# EAGLE design SmoothieboardGlcdAdapter2 (EAGLE 6.6.0)
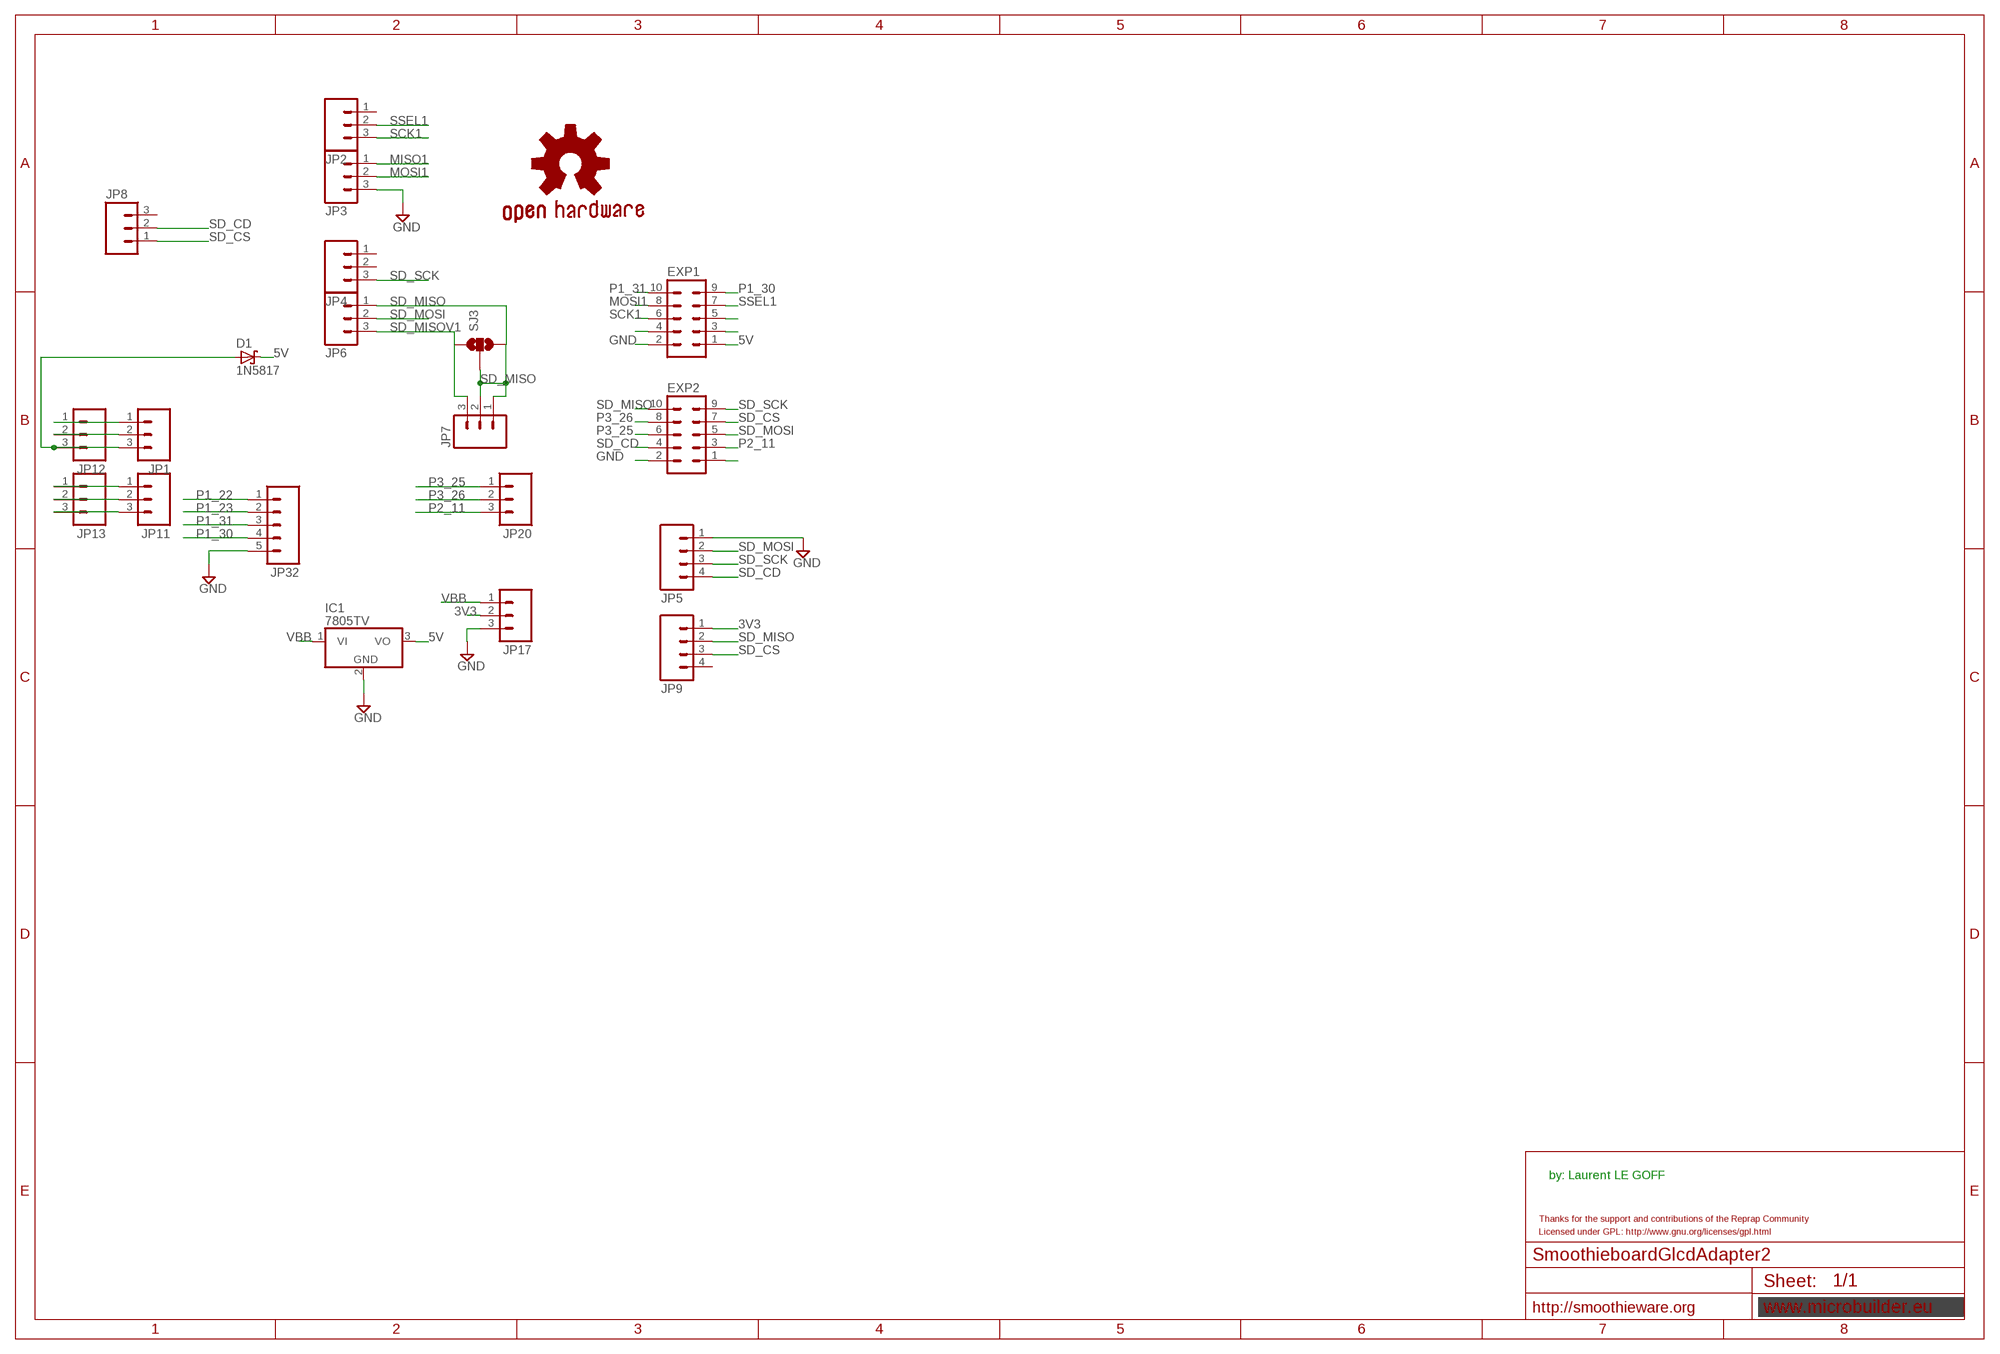
[diagram p0: schematic, sheet 1]

## Parts
D1  1N5817  1N5817-B  [DO41-7.6]
EXP1  ML10  [ML10]
EXP2  ML10  [ML10]
GOLD_ORB_SM1  OSHWLOGO_GOLD_ORB_MED  [OSHW1]
IC1  7805TV  [TO220V]
JP1  M03PTH  [1X03]
JP2  M031X03_NO_SILK  [1X03_NO_SILK]
JP3  M031X03_NO_SILK  [1X03_NO_SILK]
JP4  M031X03_NO_SILK  [1X03_NO_SILK]
JP5  M041X04_NO_SILK  [1X04_NO_SILK]
JP6  M031X03_NO_SILK  [1X03_NO_SILK]
JP7  M03PTH  [1X03]
JP8  M03PTH  [1X03]
JP9  M041X04_NO_SILK  [1X04_NO_SILK]
JP11  M03PTH  [1X03]
JP12  M03PTH  [1X03]
JP13  M03PTH  [1X03]
JP17  M03PTH  [1X03]
JP20  M03PTH  [1X03]
JP32  M05PTH  [1X05]
SJ3  SOLDERJUMPER_2WAYS  [SJ_3]

## Nets
3V3: JP9.1 JP17.2
5V: D1.C EXP1.1 IC1.3(VO)
GND: EXP1.2 EXP2.2 IC1.2(GND) JP3.3 JP5.1 JP17.3 JP32.5
MISO1: JP3.1
MOSI1: EXP1.8 JP3.2
N$1: D1.A JP1.3 JP12.3
N$2: JP1.1 JP12.1
N$3: JP1.2 JP12.2
N$5: EXP1.4
N$6: JP11.1 JP13.1
N$7: JP11.2 JP13.2
N$8: JP11.3 JP13.3
N$9: EXP1.5
N$10: EXP1.3
N$21: EXP2.1
P1_22: JP32.1
P1_23: JP32.2
P1_30: EXP1.9 JP32.4
P1_31: EXP1.10 JP32.3
P2_11: EXP2.3 JP20.3
P3_25: EXP2.6 JP20.1
P3_26: EXP2.8 JP20.2
SCK1: EXP1.6 JP2.3
SD_CD: EXP2.4 JP5.4 JP8.2
SD_CS: EXP2.7 JP8.1 JP9.3
SD_MISO: EXP2.10 JP6.1 JP7.1 JP7.2 JP9.2 SJ3.2 SJ3.3
SD_MISOV1: JP6.3 JP7.3 SJ3.1
SD_MOSI: EXP2.5 JP5.2 JP6.2
SD_SCK: EXP2.9 JP4.3 JP5.3
SSEL1: EXP1.7 JP2.2
VBB: IC1.1(VI) JP17.1
Unconnected: JP2.1 JP4.1 JP4.2 JP8.3 JP9.4

## Notes on the sheet
- by: Laurent LE GOFF
- Thanks for the support and contributions of the Reprap Community
- Licensed under GPL: http://www.gnu.org/licenses/gpl.html
- http://smoothieware.org

## Library data of the parts
D1 = diode:1N581*: 1.0A SCHOTTKY BARRIER RECTIFIER Source: http://www.diodes.com/datasheets/ds23001.pdf
EXP1 EXP2 = con-harting-ml:ML10: HARTING; OC_FARNELL: unknown; OC_NEWARK: unknown
GOLD_ORB_SM1 = bfl:OSHWLOGO: These are Open-Source Hardware logos.
IC1 = linear:78*: Positive VOLTAGE REGULATOR Source: http://cache.national.com/ds/LM/LM78L05.pdf http://www.fairchildsemi.com/ds/LM/LM7805.pdf
JP1-JP4 JP6-JP8 JP11-JP13 JP17 JP20 = SparkFun:M03: Header 3 Standard 3-pin 0.1" header. Use with straight break away headers (SKU : PRT-00116), right angle break away headers (PRT-00553), swiss pins (PRT-00743), machine pins (PRT-00117), and female headers (PRT-00115). Molex polarized connector foot print use with SKU : PRT-08232 with associated crimp pins and housings.
JP5 JP9 = SparkFun:M04: Header 4 Standard 4-pin 0.1" header. Use with straight break away headers (SKU : PRT-00116), right angle break away headers (PRT-00553), swiss pins (PRT-00743), machine pins (PRT-00117), and female headers (PRT-00115). Molex polarized connector foot print use with SKU : PRT-08231 with associated crimp pins and housings. 1MM SMD Version SKU: PRT-10208
JP32 = SparkFun:M05: Header 5 Standard 5-pin 0.1" header. Use with straight break away headers (SKU : PRT-00116), right angle break away headers (PRT-00553), swiss pins (PRT-00743), machine pins (PRT-00117), and female headers (PRT-00115). Molex polarized connector foot print use with SKU : PRT-08230 with associated crimp pins and housings.
SJ3 = SparkFun:SOLDERJUMPER_2WAY: Solder Jumper 2 way solder jumper

## Board
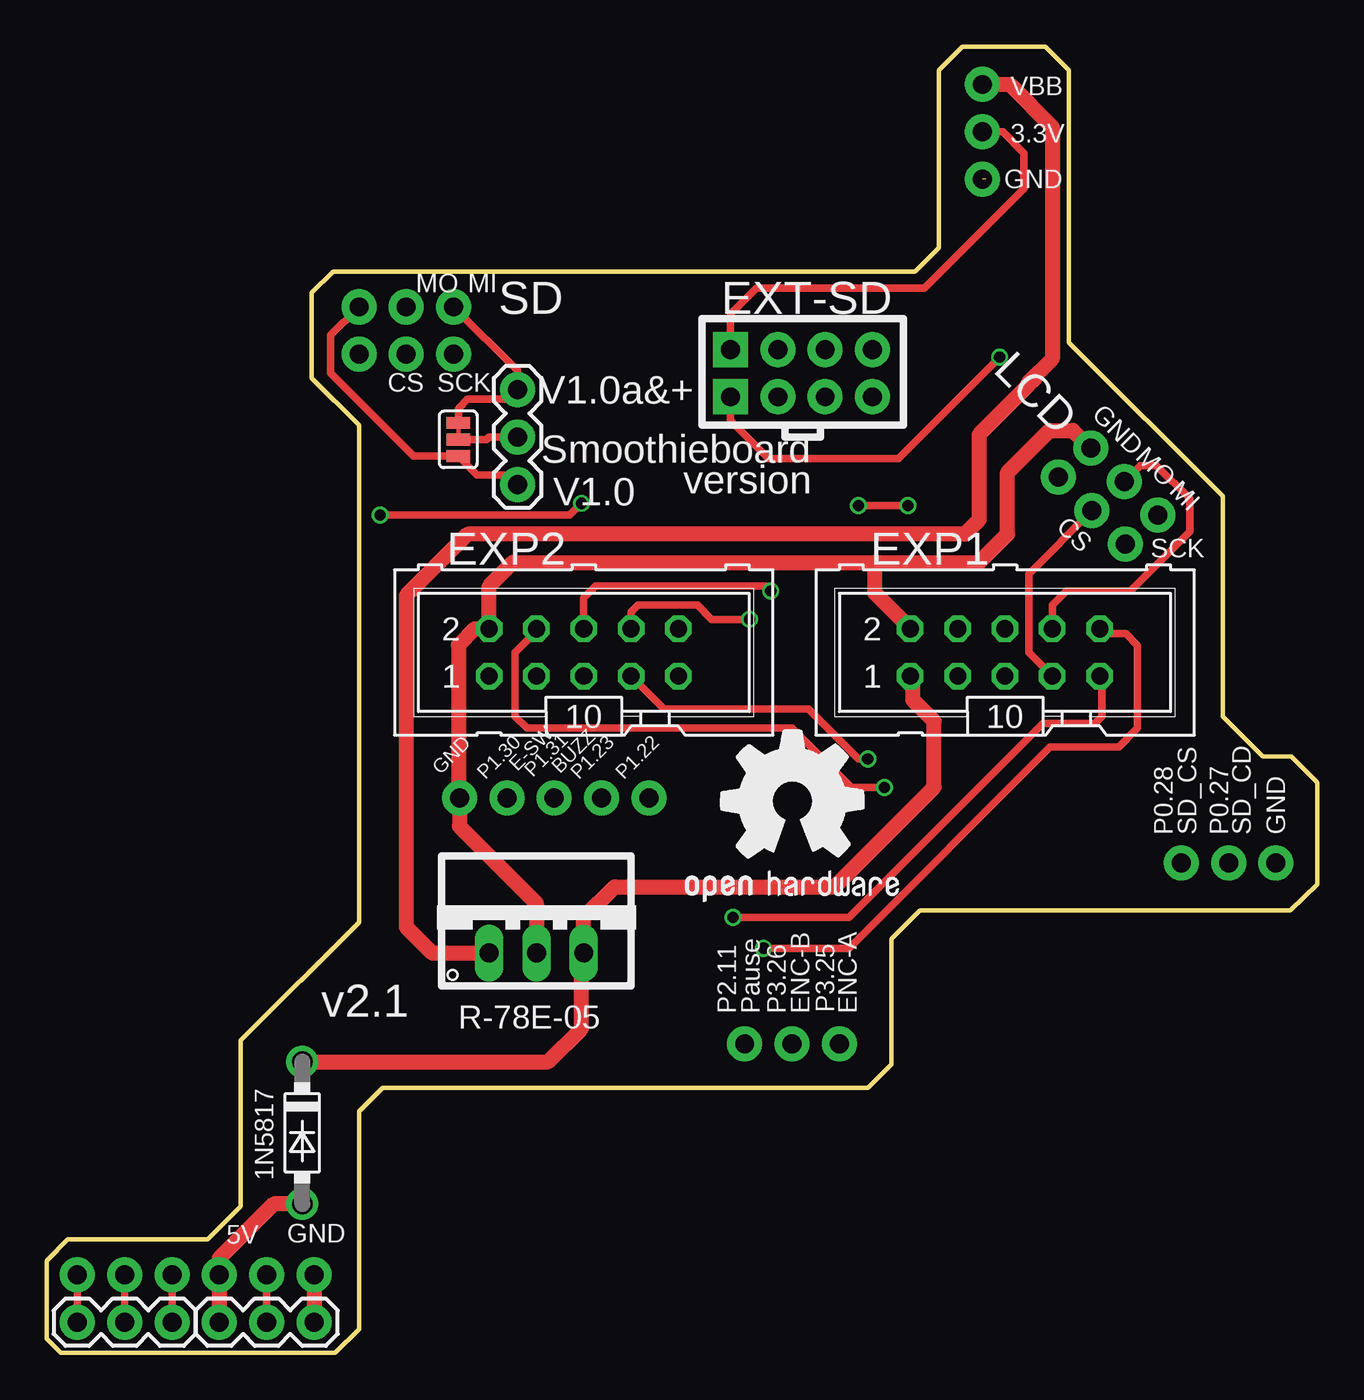
[diagram p1: board, top side]
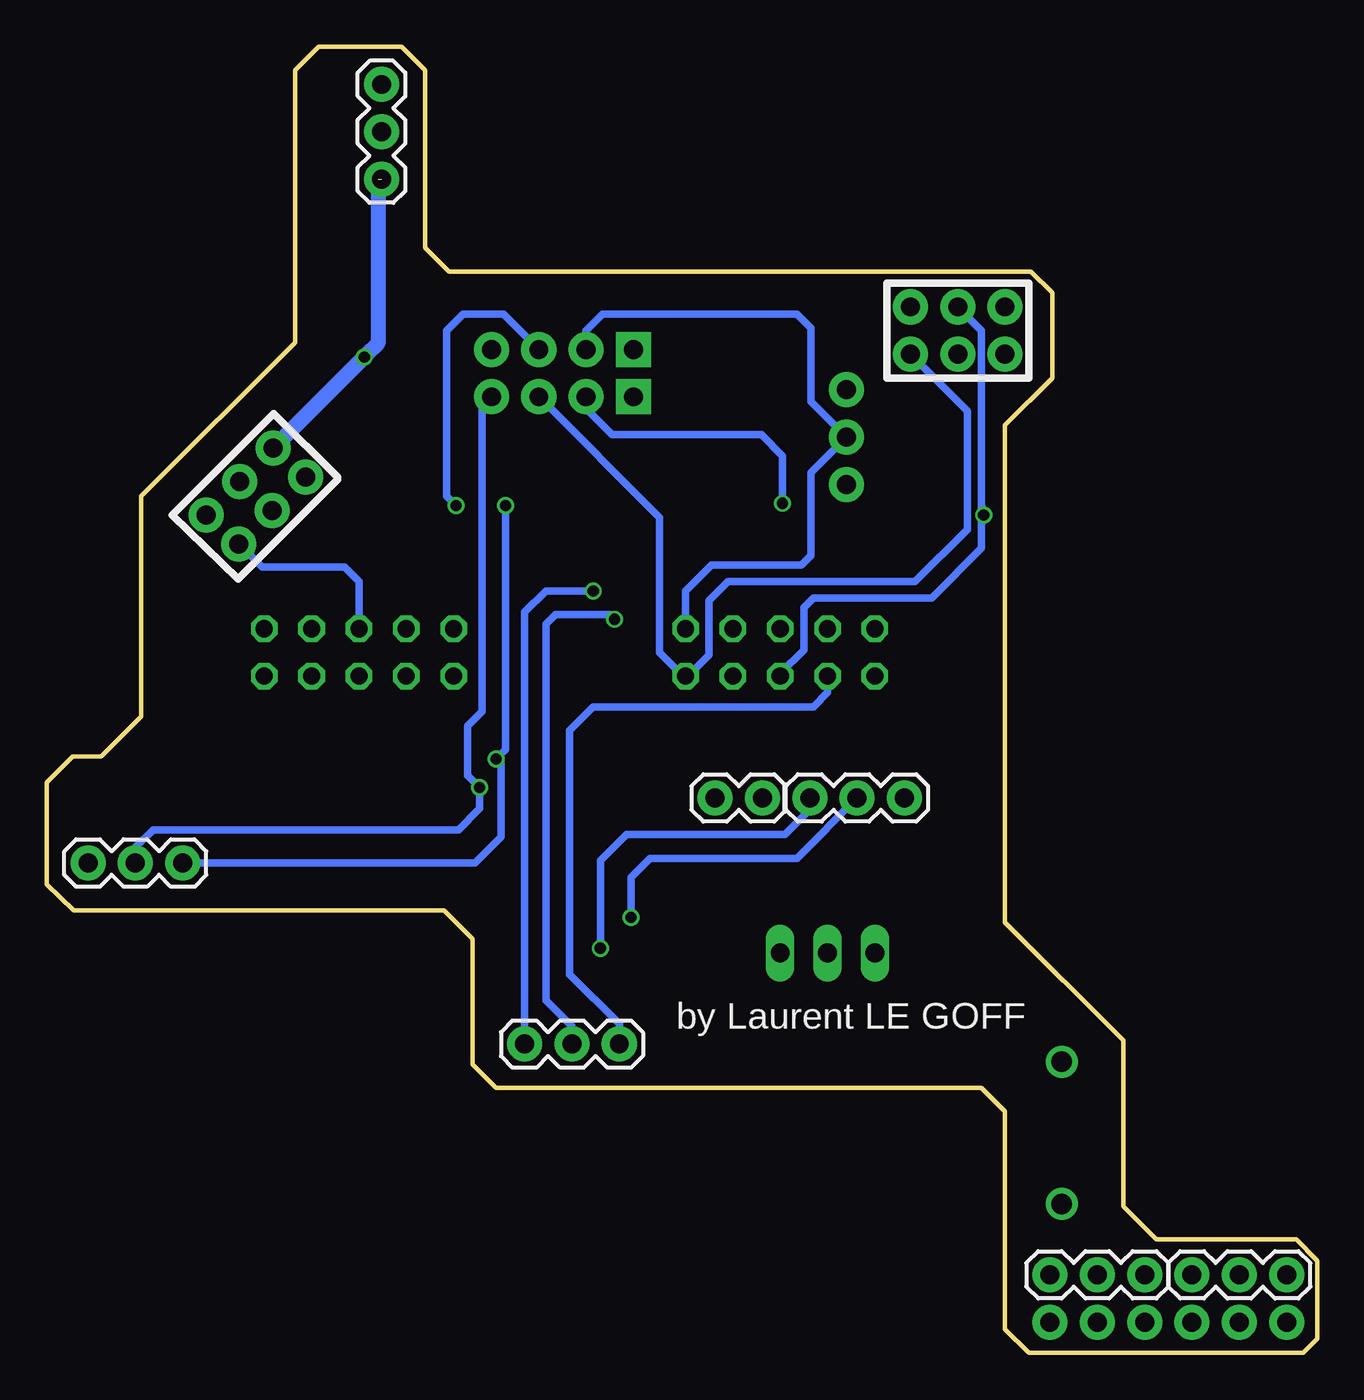
[diagram p2: board, bottom side, seen from below]

Size 68.2 x 70.1 mm. Coordinates in mm from the lower left corner, seen from the top.
Outline: 15.37,58.04 46.61,58.04 47.88,59.31 47.88,68.83 49.15,70.1 53.59,70.1 54.86,68.83 54.86,54.23 63.12,45.97 63.12,34.16 65.28,32 66.8,32 68.2,30.61 68.2,25.15 66.74,23.75 46.86,23.75 45.34,22.23 45.34,15.49 44.07,14.22 18.03,14.22 16.76,12.95 16.76,1.27 15.49,0 0.76,0 0,0.76 0,4.95 1.14,6.1 8.64,6.1 10.41,7.87 10.41,16.76 16.76,23.11 16.76,49.78 14.22,52.32 14.22,56.9 15.37,58.04
Copper layers (1*16): Top 0.035mm / dielectric 1.5mm / Bottom 0.035mm
Design rules "dirt_cheap_dirty_boards.v1": minimum track width 5mil, minimum drill 12mil, track to track 5mil, track to pad 5mil, pad to pad 5mil, via to via 5mil, smd to smd 0mil, copper to edge 10mil, drill to drill 10mil, minimum pad ring 10mil, minimum via ring 6mil, stop-mask expansion 2mil, vias tented up to drill 25mil, thermal gap 10mil
tRestrict: 72 lines

### Footprints (pad centres in the part's own frame; a part is rotated, then mirrored left to right if it is on the bottom)
DO41-7.6 = drill 1.1 pad 1.7: A 3.81,0; C -3.81,0
ML10 = drill 0.914 octagon: 1 -5.08,-1.27; 2 -5.08,1.27; 3 -2.54,-1.27; 4 -2.54,1.27; 5 0,-1.27; 6 0,1.27; 7 2.54,-1.27; 8 2.54,1.27; 9 5.08,-1.27; 10 5.08,1.27
TO220V = drill 1.016 long: 1 -2.54,-2.54; 2 0,-2.54; 3 2.54,-2.54
1X03 = drill 1.016 pad 1.88: 1 0,0; 2 2.54,0; 3 5.08,0
1X03_NO_SILK = drill 1.016 pad 1.88: 1 0,0; 2 2.54,0; 3 5.08,0
1X04_NO_SILK = drill 1.016 pad 1.88 square: 1 0,0 | drill 1.016 pad 1.88: 2 2.54,0; 3 5.08,0; 4 7.62,0
1X05 = drill 1.016 pad 1.88: 1 0,0; 2 2.54,0; 3 5.08,0; 4 7.62,0; 5 10.16,0
SJ_3 = smd 0.635 x 1.27: 1 -0.889,0; 2 0,0; 3 0.889,0

### Placement (x,y rotation side)
D1  13.72,11.81 270 top
EXP1  51.44,37.59 0 top
EXP2  28.83,37.59 0 top
GOLD_ORB_SM1  33.66,22.48 0 top
IC1  26.29,24 0 top
JP1  14.35,1.65 180 top
JP2  54.29,46.99 315 top
JP3  59.63,44.96 135 top
JP4  16.76,53.59 0 top
JP5  36.7,51.31 0 top
JP6  21.84,56.13 180 top
JP7  25.27,51.69 270 top
JP8  60.9,26.29 180 bottom
JP9  36.7,53.85 0 top
JP11  1.65,4.19 180 bottom
JP12  14.35,4.19 0 bottom
JP13  1.65,1.65 0 top
JP17  50.23,68.07 270 bottom
JP20  42.55,16.57 0 bottom
JP32  32.32,29.78 0 bottom
SJ3  22.1,49.02 90 top

### Tracks (layer width: path | path; a pad name or v marks a point on that pad's centre or on a via)
3V3
  Top 0.406: JP17.2 51.31,65.53 52.45,64.39 52.45,62.48 47.12,57.15 38.1,57.15 36.7,55.75 JP9.1
5V
  Top 0.813: D1.C 26.92,15.62 28.7,17.4 28.7,21.34 IC1.3 28.83,23.37 30.48,25.02 42.29,25.02 47.62,30.35 47.62,33.91 46.48,35.05 46.48,36.2 EXP1.1
GND  (via drill 0.6)  (1 unrouted)
  Top 0.406: JP5.1 36.7,50.04 38.73,48.01 45.72,48.01 v51.15,53.44
  Top 0.813: EXP1.2 44.45,40.77 44.45,42.42 | 44.45,42.42 25.02,42.42 23.75,41.15 EXP2.2 22.99,38.86 22.1,37.97 22.1,29.84 JP32.5 22.16,28.26 26.29,24.13 IC1.2 | 44.45,42.42 50.04,42.42 51.56,43.94 51.56,47.24 53.82,49.5 55.09,49.5 JP3.3
  Bottom 0.813: 50.42,62.99 50.42,54.16 51.02,53.56 v51.15,53.44 JP3.3
MOSI1
  Top 0.406: EXP1.8 53.97,40.13 54.74,40.89 58.17,40.89 61.34,44.07 61.34,45.85 59.56,47.62 58.7,47.62 JP3.2
N$1
  Top 0.813: D1.A 12.19,8 9.27,5.08 JP12.3 JP1.3
N$2
  Top 0.813: JP12.1 JP1.1
N$3
  Top 0.406: JP12.2 JP1.2
N$6
  Top 0.406: JP11.1 JP13.1
N$7
  Top 0.406: JP11.2 JP13.2
N$8
  Top 0.406: JP11.3 JP13.3
P1_30  (via drill 0.6)
  Top 0.406: v36.83,23.37 43.05,23.37 53.47,33.78 56.26,33.78 56.64,34.16 56.64,36.2 EXP1.9
  Bottom 0.406: v36.83,23.37 36.83,25.53 35.81,26.54 27.94,26.54 JP32.4
P1_31  (via drill 0.6)
  Top 0.406: v38.48,21.72 43.05,21.72 53.85,32.51 57.53,32.51 58.55,33.53 58.55,37.97 57.91,38.61 56.77,38.61 EXP1.10
  Bottom 0.406: v38.48,21.72 38.48,26.42 37.08,27.81 28.57,27.81 27.31,29.08 27.31,29.72 JP32.3
P2_11
  Bottom 0.406: EXP2.3 26.29,35.43 27.05,34.67 38.86,34.67 40.13,33.4 40.13,20.32 37.47,17.65 JP20.3
P3_25  (via drill 0.6)
  Top 0.406: EXP2.6 28.83,40.51 29.46,41.15 38.61,41.15 v38.86,40.89
  Bottom 0.406: v38.86,40.89 41.4,40.89 42.55,39.75 JP20.1
P3_26  (via drill 0.6)
  Top 0.406: v37.72,39.37 35.69,39.37 34.92,40.13 31.75,40.13 31.37,39.75 EXP2.8
  Bottom 0.406: v37.72,39.37 37.97,39.62 40.89,39.62 41.4,39.12 41.4,18.92 40,17.53 JP20.2
SCK1
  Bottom 0.406: JP2.3 56.64,42.16 52.2,42.16 51.44,41.4 EXP1.6
SD_CD  (via drill 0.6)
  Top 0.406: v44.96,30.35 43.18,30.35 40,33.53 25.78,33.53 25.15,34.16 25.15,37.59 26.29,38.73 EXP2.4
  Bottom 0.406: JP5.4 44.45,51.31 44.83,50.93 44.83,34.42 45.59,33.66 45.59,30.99 v44.96,30.35 44.96,29.21 46.1,28.07 62.48,28.07 63.44,27.11 JP8.2
SD_CS  (via drill 0.6)
  Top 0.406: v44.07,31.88 43.56,31.88 40.89,34.54 33.15,34.54 EXP2.7 | v46.23,45.47 v43.56,45.47
  Bottom 0.406: JP9.3 43.69,55.75 45.85,55.75 46.74,54.86 46.74,45.97 v46.23,45.47 | v43.56,45.47 43.56,32.38 v44.07,31.88 43.81,31.62 43.81,27.69 45.21,26.29 JP8.1
SD_MISO
  Top 0.254: SJ3.3 SJ3.2
  Top 0.406: JP6.1 25.27,52.7 JP7.1 24.77,51.18 22.61,51.18 22.1,50.67 SJ3.3 | SJ3.2 23.62,49.02 23.75,49.15 JP7.2
  Bottom 0.406: EXP2.10 33.91,40.89 32.51,42.29 27.69,42.29 27.18,42.8 27.18,47.24 JP7.2 27.18,51.05 27.18,54.99 27.94,55.75 38.35,55.75 39.24,54.86 JP9.2
SD_MISOV1
  Top 0.406: JP6.3 15.24,54.61 15.24,52.58 19.68,48.13 SJ3.1 23.11,47.12 24.77,47.12 JP7.3
SD_MOSI  (via drill 0.6)
  Top 0.406: v28.7,45.59 28.07,44.96 v17.91,44.96
  Bottom 0.406: JP6.2 18.03,54.86 18.03,45.47 | 18.03,45.47 18.03,43.18 20.7,40.51 27.05,40.51 27.56,40.01 27.56,37.72 28.83,36.45 EXP2.5 | JP5.2 39.24,50.67 37.85,49.28 29.85,49.28 28.7,48.13 v28.7,45.59 | v17.91,44.96 18.03,45.47
SD_SCK
  Bottom 0.406: JP4.3 18.8,50.55 18.8,44.2 21.59,41.4 31.62,41.4 32.64,40.39 32.64,37.47 33.78,36.32 EXP2.9 34.04,36.32 35.31,37.59 35.31,44.83 JP5.3
SSEL1
  Top 0.406: JP2.2 52.7,41.81 52.7,37.59 EXP1.7
VBB
  Top 0.813: JP17.1 51.69,68.07 53.97,65.79 53.97,53.34 52.64,52.01 52.64,51.88 | IC1.1 20.7,21.46 19.3,22.86 19.3,40.64 22.61,43.94 49.28,43.94 50.04,44.7 50.04,49.28 52.64,51.88 | 53.09,52.32 52.64,51.88

### Text on the board
tPlace: R-78E-05
bPlace: by Laurent LE GOFF
_tsilk: VBB | 3.3V | GND | MO | MI | SD | EXT-SD | CS | SCK | V1.0a&+ | LCD | GND | Smoothieboard | MO | MI | V1.0 | version | CS | SCK | E-SW | GND | P1.30 | P1.31 | BUZZ | P1.23 | P1.22 | P0.28 | SD_CS | P0.27 | SD_CD | GND | P2.11 | Pause | P3.26 | ENC-B | P3.25 | ENC-A | v2.1 | 1N5817 | 5V | GND